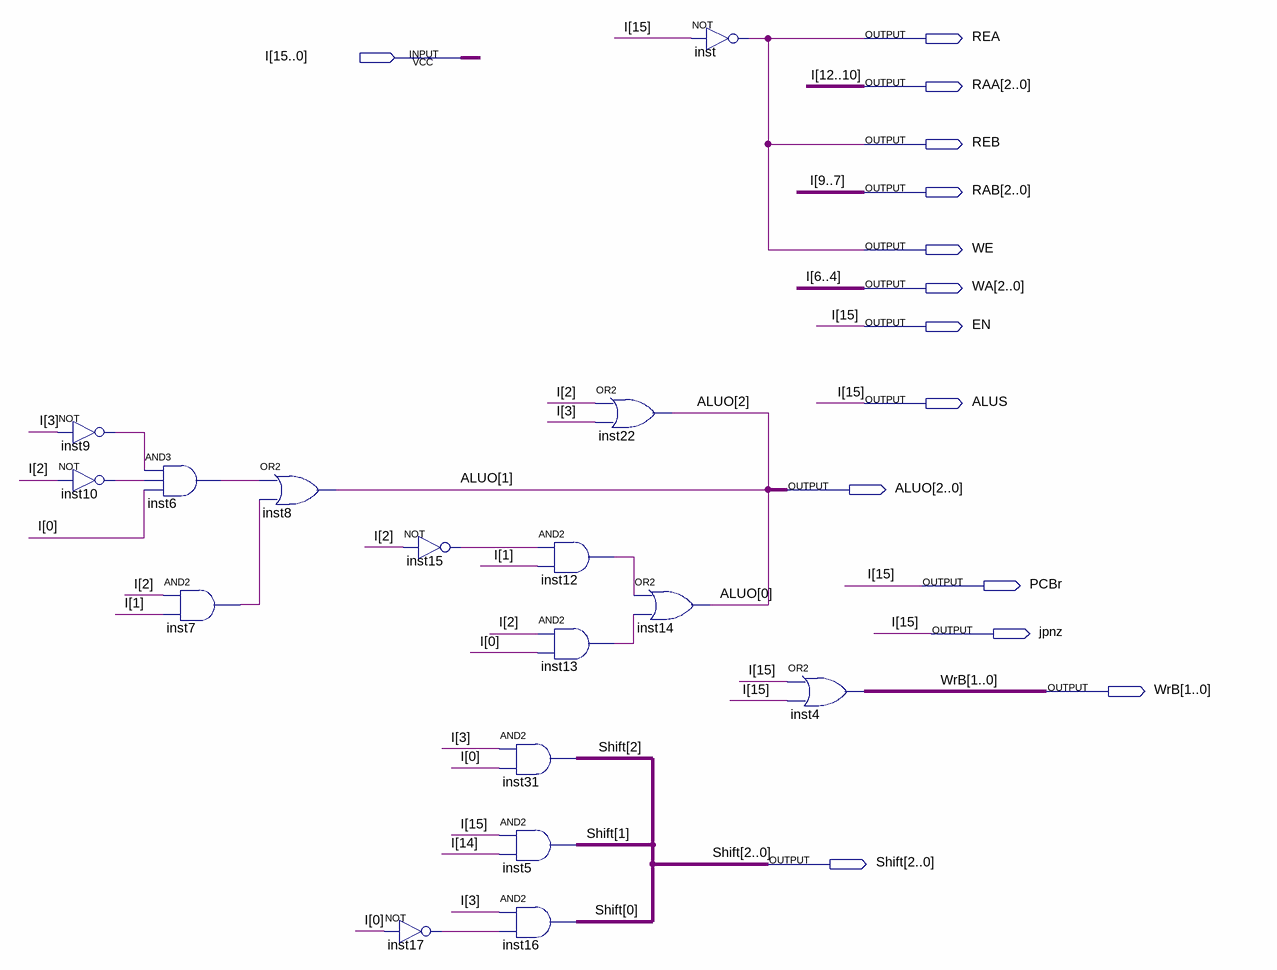
[diagram p0: schematic sheet]
// Quartus schematic RRR.bdf as structural Verilog: 16 symbols, 14 pins
module RRR (
  input  [15:0] I,
  output REA,
  output [2:0] RAA,
  output REB,
  output [2:0] RAB,
  output WE,
  output [2:0] WA,
  output EN,
  output ALUS,
  output [2:0] ALUO,
  output PCBr,
  output jpnz,
  output [1:0] WrB,
  output [2:0] Shift
);

  wire inst6_out, inst7_out, inst9_out, inst10_out, inst12_out, inst13_out, inst15_out, inst17_out;

  not inst9 (inst9_out, I[3]);
  not inst10 (inst10_out, I[2]);
  and inst6 (inst6_out, inst9_out, inst10_out, I[0]);
  and inst7 (inst7_out, I[2], I[1]);
  or inst8 (ALUO[1], inst6_out, inst7_out);
  not inst15 (inst15_out, I[2]);
  not inst17 (inst17_out, I[0]);
  and inst31 (Shift[2], I[3], I[0]);
  and inst5 (Shift[1], I[15], I[14]);
  and inst16 (Shift[0], I[3], inst17_out);
  and inst12 (inst12_out, inst15_out, I[1]);
  and inst13 (inst13_out, I[2], I[0]);
  or inst22 (ALUO[2], I[2], I[3]);
  or inst14 (ALUO[0], inst12_out, inst13_out);
  not inst (REA, I[15]);
  assign WrB = {2{I[15]}} | {2{I[15]}};  // OR2 inst4, 2 bits wide

  assign ALUS = I[15];
  assign EN = I[15];
  assign jpnz = I[15];
  assign PCBr = I[15];
  assign RAA = I[12:10];
  assign RAB = I[9:7];
  assign REB = REA;
  assign WA = I[6:4];
  assign WE = REA;
endmodule
